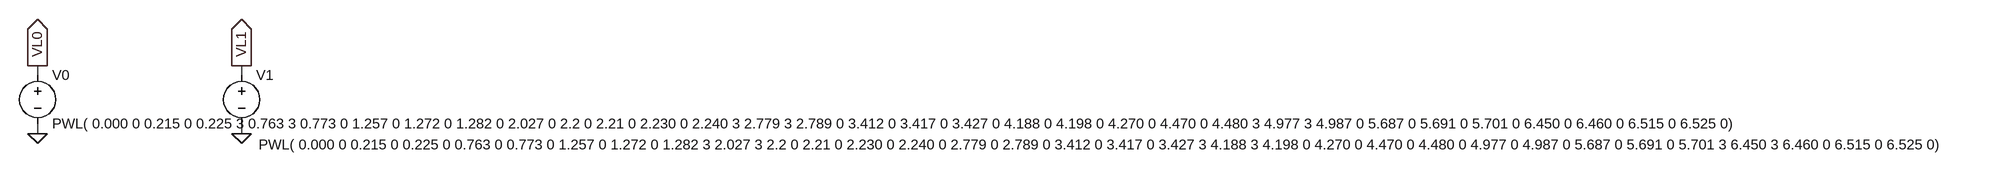
[diagram p0: schematic OutputLabels.asc]
OutputLabels.asc, the LTspice schematic file:
Version 4
SHEET 1 5664 680
WIRE 64 64 64 48
WIRE 400 64 400 48
WIRE 64 160 64 144
WIRE 400 160 400 144
FLAG 64 48 VL0
IOPIN 64 48 Out
FLAG 64 160 0
FLAG 400 48 VL1
IOPIN 400 48 Out
FLAG 400 160 0
SYMBOL voltage 64 48 R0
WINDOW 123 0 0 Left 2
WINDOW 39 0 0 Left 2
SYMATTR InstName V0
SYMATTR Value PWL( 0.000 0 0.215 0 0.225 3 0.763 3 0.773 0 1.257 0 1.272 0 1.282 0 2.027 0 2.2 0 2.21 0 2.230 0 2.240 3 2.779 3 2.789 0 3.412 0 3.417 0 3.427 0 4.188 0 4.198 0 4.270 0 4.470 0 4.480 3 4.977 3 4.987 0 5.687 0 5.691 0 5.701 0 6.450 0 6.460 0 6.515 0 6.525 0)
SYMBOL voltage 400 48 R0
WINDOW 123 0 0 Left 2
WINDOW 39 0 0 Left 2
WINDOW 3 28 130 Left 2
SYMATTR Value PWL( 0.000 0 0.215 0 0.225 0 0.763 0 0.773 0 1.257 0 1.272 0 1.282 3 2.027 3 2.2 0 2.21 0 2.230 0 2.240 0 2.779 0 2.789 0 3.412 0 3.417 0 3.427 3 4.188 3 4.198 0 4.270 0 4.470 0 4.480 0 4.977 0 4.987 0 5.687 0 5.691 0 5.701 3 6.450 3 6.460 0 6.515 0 6.525 0)
SYMATTR InstName V1

The netlist it stands for:
* OutputLabels.asc
V0 VL0 0 PWL( 0.000 0 0.215 0 0.225 3 0.763 3 0.773 0 1.257 0 1.272 0 1.282 0 2.027 0 2.2 0 2.21 0 2.230 0 2.240 3 2.779 3 2.789 0 3.412 0 3.417 0 3.427 0 4.188 0 4.198 0 4.270 0 4.470 0 4.480 3 4.977 3 4.987 0 5.687 0 5.691 0 5.701 0 6.450 0 6.460 0 6.515 0 6.525 0)
V1 VL1 0 PWL( 0.000 0 0.215 0 0.225 0 0.763 0 0.773 0 1.257 0 1.272 0 1.282 3 2.027 3 2.2 0 2.21 0 2.230 0 2.240 0 2.779 0 2.789 0 3.412 0 3.417 0 3.427 3 4.188 3 4.198 0 4.270 0 4.470 0 4.480 0 4.977 0 4.987 0 5.687 0 5.691 0 5.701 3 6.450 3 6.460 0 6.515 0 6.525 0)
.backanno
.end